# Altium schematic sheet Sheet1.SchDoc
size A3
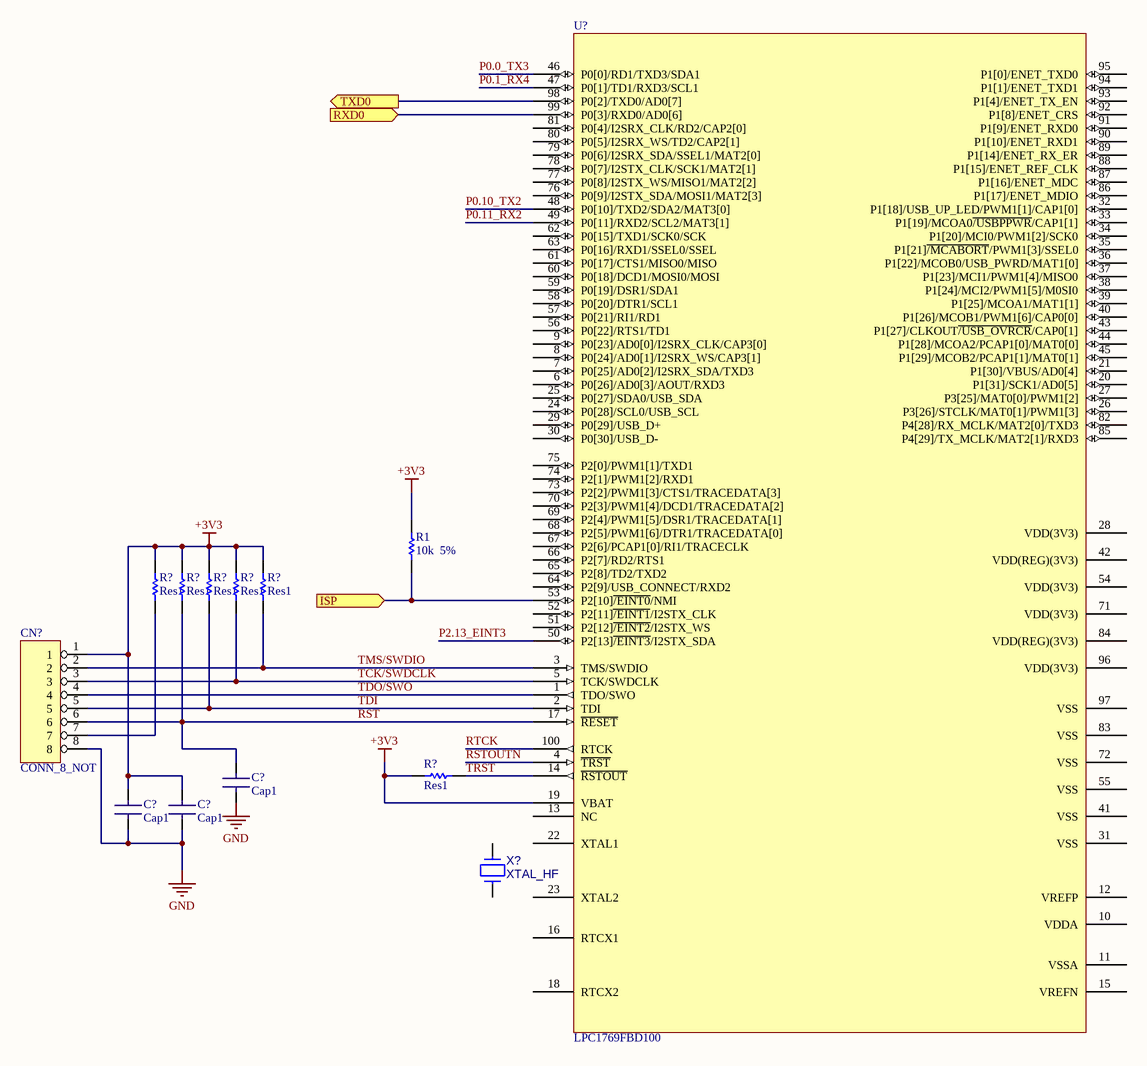
[diagram p0: Sheet1.SchDoc]

## Parts
(Parts that share a designator on the sheet are numbered #1, #2 ... from top to bottom, then left to right.)
C?#1  Cap1
C?#2  Cap1
C?#3  Cap1
CN?  CONN_8_NOT
R1  10k  5%
R?#1  Res1
R?#2  Res1
R?#3  Res1
R?#4  Res1
R?#5  Res1
R?#6  Res1
U?  LPC1769FBD100  [LQFP100]
X?  XTAL_HF

## Ports
ISP (in), RXD0 (in), TXD0 (out)

## Nets
+3V3: C?#2.1 C?#3.1 CN?.1 R1.2 R?#1.2 R?#2.2 R?#3.2 R?#4.2 R?#5.2 R?#6.2 U?.19(VBAT)
GND: C?#1.2 C?#2.2 C?#3.2 CN?.8
ISP: R1.1 U?.53(P2[10]~{/EINT0}/NMI) ; port ISP
P0.0_TX3: U?.46(P0[0]/RD1/TXD3/SDA1)
P0.1_RX4: U?.47(P0[1]/TD1/RXD3/SCL1)
P0.10_TX2: U?.48(P0[10]/TXD2/SDA2/MAT3[0])
P0.11_RX2: U?.49(P0[11]/RXD2/SCL2/MAT3[1])
P2.13_EINT3: U?.50(P2[13]~{/EINT3}/I2STX_SDA)
RST: C?#1.1 CN?.6 R?#2.1 U?.17(~{RESET})
RSTOUTN: U?.4(~{TRST})
RTCK: U?.100(RTCK)
RXD0: U?.99(P0[3]/RXD0/AD0[6]) ; port RXD0
TCK/SWDCLK: CN?.3 R?#4.1 U?.5(TCK/SWDCLK)
TDI: CN?.5 R?#3.1 U?.2(TDI)
TDO/SWO: CN?.4 U?.1(TDO/SWO)
TMS/SWDIO: CN?.2 R?#5.1 U?.3(TMS/SWDIO)
TRST: R?#6.1 U?.14(~{RSTOUT})
TXD0: U?.98(P0[2]/TXD0/AD0[7]) ; port TXD0
NetCN?_7: CN?.7 R?#1.1

Not connected (* = marked no-connect by the designer): U? 6(P0[26]/AD0[3]/AOUT/RXD3) 7(P0[25]/AD0[2]/I2SRX_SDA/TXD3) 8(P0[24]/AD0[1]/I2SRX_WS/CAP3[1]) 9(P0[23]/AD0[0]/I2SRX_CLK/CAP3[0]) 10(VDDA) 11(VSSA) 12(VREFP) 13(NC) 15(VREFN) 16(RTCX1) 18(RTCX2) 20(P1[31]/SCK1/AD0[5]) 21(P1[30]/VBUS/AD0[4]) 22(XTAL1) 23(XTAL2) 24(P0[28]/SCL0/USB_SCL) 25(P0[27]/SDA0/USB_SDA) 26(P3[26]/STCLK/MAT0[1]/PWM1[3]) 27(P3[25]/MAT0[0]/PWM1[2]) 28(VDD(3V3)) 29(P0[29]/USB_D+) 30(P0[30]/USB_D-) 31(VSS) 32(P1[18]/USB_UP_LED/PWM1[1]/CAP1[0]) 33(P1[19]/MCOA0~{/USBPPWR}/CAP1[1]) 34(P1[20]/MCI0/PWM1[2]/SCK0) 35(P1[21]~{/MCABORT}/PWM1[3]/SSEL0) 36(P1[22]/MCOB0/USB_PWRD/MAT1[0]) 37(P1[23]/MCI1/PWM1[4]/MISO0) 38(P1[24]/MCI2/PWM1[5]/M0SI0) 39(P1[25]/MCOA1/MAT1[1]) 40(P1[26]/MCOB1/PWM1[6]/CAP0[0]) 41(VSS) 42(VDD(REG)(3V3)) 43(P1[27]/CLKOUT~{/USB_OVRCR}/CAP0[1]) 44(P1[28]/MCOA2/PCAP1[0]/MAT0[0]) 45(P1[29]/MCOB2/PCAP1[1]/MAT0[1]) 51(P2[12]~{/EINT2}/I2STX_WS) 52(P2[11]~{/EINT1}/I2STX_CLK) 54(VDD(3V3)) 55(VSS) 56(P0[22]/RTS1/TD1) 57(P0[21]/RI1/RD1) 58(P0[20]/DTR1/SCL1) 59(P0[19]/DSR1/SDA1) 60(P0[18]/DCD1/MOSI0/MOSI) 61(P0[17]/CTS1/MISO0/MISO) 62(P0[15]/TXD1/SCK0/SCK) 63(P0[16]/RXD1/SSEL0/SSEL) 64(P2[9]/USB_CONNECT/RXD2) 65(P2[8]/TD2/TXD2) 66(P2[7]/RD2/RTS1) 67(P2[6]/PCAP1[0]/RI1/TRACECLK) 68(P2[5]/PWM1[6]/DTR1/TRACEDATA[0]) 69(P2[4]/PWM1[5]/DSR1/TRACEDATA[1]) 70(P2[3]/PWM1[4]/DCD1/TRACEDATA[2]) 71(VDD(3V3)) 72(VSS) 73(P2[2]/PWM1[3]/CTS1/TRACEDATA[3]) 74(P2[1]/PWM1[2]/RXD1) 75(P2[0]/PWM1[1]/TXD1) 76(P0[9]/I2STX_SDA/MOSI1/MAT2[3]) 77(P0[8]/I2STX_WS/MISO1/MAT2[2]) 78(P0[7]/I2STX_CLK/SCK1/MAT2[1]) 79(P0[6]/I2SRX_SDA/SSEL1/MAT2[0]) 80(P0[5]/I2SRX_WS/TD2/CAP2[1]) 81(P0[4]/I2SRX_CLK/RD2/CAP2[0]) 82(P4[28]/RX_MCLK/MAT2[0]/TXD3) 83(VSS) 84(VDD(REG)(3V3)) 85(P4[29]/TX_MCLK/MAT2[1]/RXD3) 86(P1[17]/ENET_MDIO) 87(P1[16]/ENET_MDC) 88(P1[15]/ENET_REF_CLK) 89(P1[14]/ENET_RX_ER) 90(P1[10]/ENET_RXD1) 91(P1[9]/ENET_RXD0) 92(P1[8]/ENET_CRS) 93(P1[4]/ENET_TX_EN) 94(P1[1]/ENET_TXD1) 95(P1[0]/ENET_TXD0) 96(VDD(3V3)) 97(VSS); X? 1 2

## Library data of the parts
C?#1-C?#3 = Cap1: Capacitor
CN? = CONN_8_NOT: Connector 8 Vias with point
R1 R?#1-R?#6 = Res1: Resistor
U? = LPC1768FBD100: CPU Cortex M3
X? = XTAL_HF: Crystal